# Altium schematic sheet TL200_V1.1-后板.SchDoc
size A3
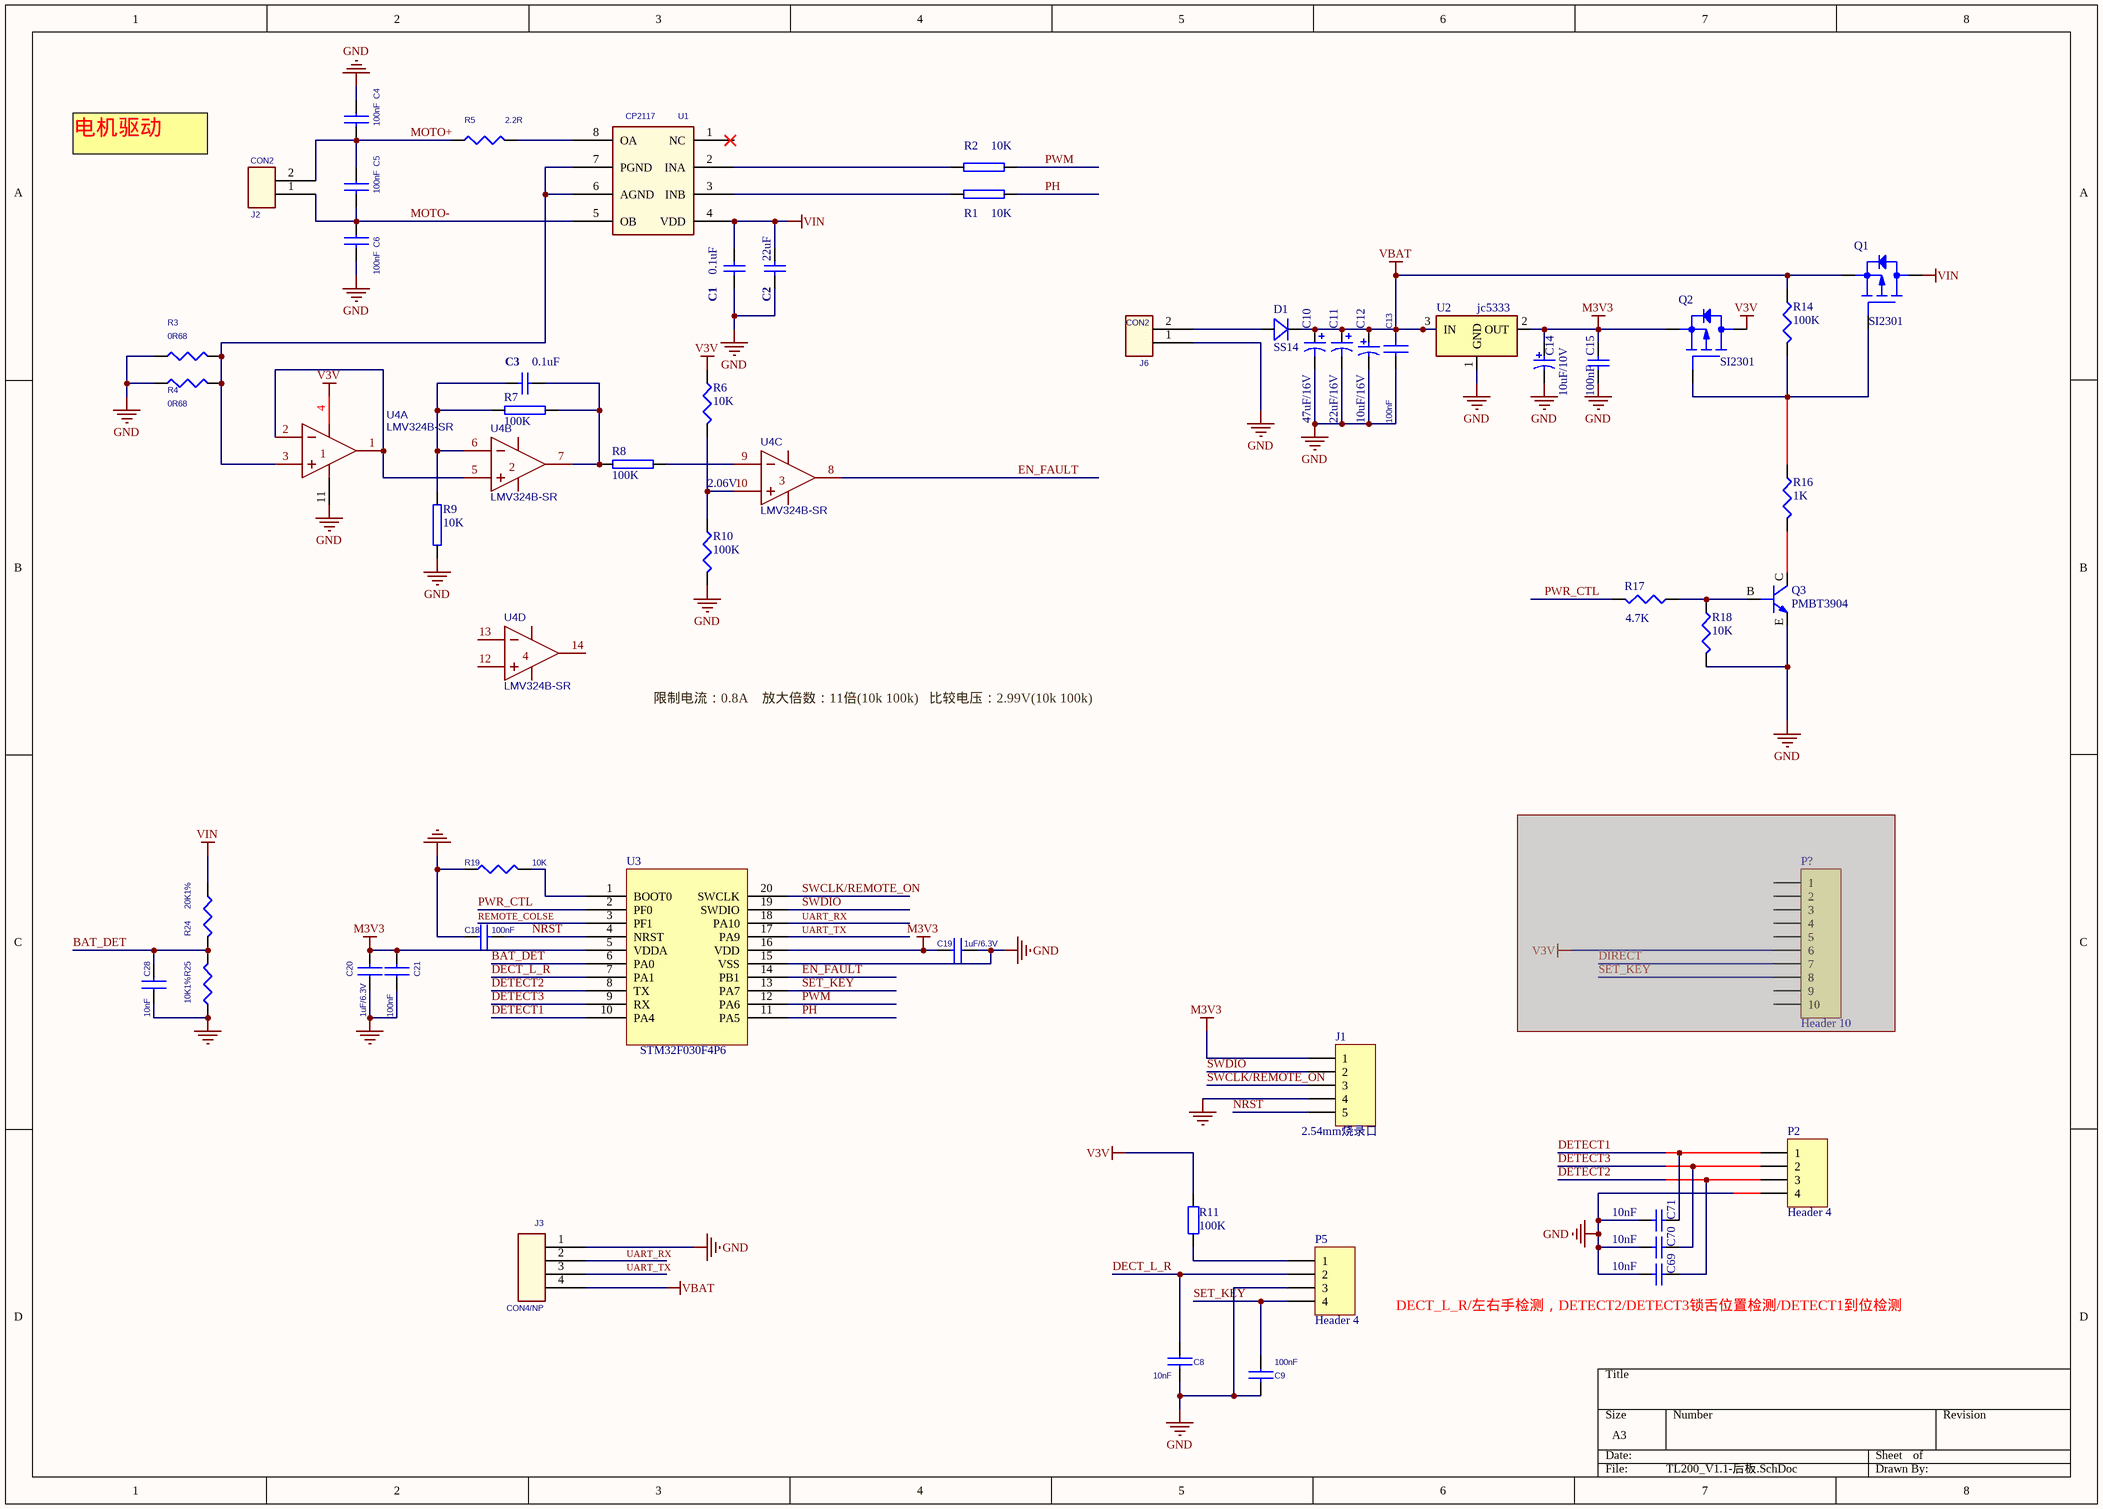
[diagram p0: TL200_V1.1-后板.SchDoc]

## Parts
C1  0.1uF  [LC-0603_C]
C2  22uF  [LC-0805_C]
C3  0.1uF  [LC-0603_C]
C4  100nF  [C0603]
C5  100nF  [C0603]
C6  100nF  [C0603]
C8  10nF  [LC-0603_C]
C9  100nF  [LC-0603_C]
C10  47uF/16V  [LC-0805_C]
C11  22uF/16V  [LC-0805_C]
C12  10uF/16V  [LC-0805_C]
C13  100nF  [C0603]
C14  10uF/10V  [LC-0805_C]
C15  100nF  [LC-0603_C]
C18  100nF  [LC-0603_C]
C19  1uF/6.3V  [LC-0603_C]
C20  1uF/6.3V  [LC-0603_C]
C21  100nF  [LC-0603_C]
C28  10nF  [LC-0603_C]
C69  10nF  [C0603]
C70  10nF  [C0603]
C71  10nF  [C0603]
D1  SS14  [M7]
J1  2.54mm烧录口  [5P-2.54mm - duplicate]
J2  CON2  [2PIN-2.0]
J3  CON4/NP  [4p-2.0xx]
J6  CON2  [2PIN-2.0]
P2  Header 4  [4P-1.25]
P5  Header 4  [4P-1.25]
P?  Header 10  [10p-2.0]  (masked out: inside a compile mask, not in the netlist)
Q1  SI2301  [SOT-23 - GDS]
Q2  SI2301  [SOT-23 - GDS]
Q3  PMBT3904  [SOT-23 - BCE]
R1  10K  [LC-0603_R]
R2  10K  [LC-0603_R]
R3  0R68  [LC-0603_R]
R4  0R68  [LC-0603_R]
R5  2.2R  [0805_R]
R6  10K  [LC-0603_R]
R7  100K  [LC-0603_R]
R8  100K  [LC-0603_R]
R9  10K  [LC-0603_R]
R10  100K  [LC-0603_R]
R11  100K  [LC-0603_R]
R14  100K  [LC-0603_R]
R16  1K  [LC-0603_R]
R17  4.7K  [LC-0603_R]
R18  10K  [LC-0603_R]
R19  10K  [LC-0603_R]
R24  20K1%  [LC-0603_R]
R25  10K1%  [LC-0603_R]
U1  CP2117  [SOP8]
U2  jc5333  [SOT-23-3L]
U3  STM32F030F4P6  [TSSOP20L1xx]
U4  LMV324B-SR  [SOIC-14_L8.7-W3.9-P1.27-LS6.0-BL]  (parts A,B,C,D of 4)

## Nets
GND: C1.2 C2.2 C4.1 C6.2 C8.2 C9.2 C10.2 C11.2 C12.2 C13.2 C14.2 C15.2 C18.1 C19.1 C20.1 C21.1 C28.1 C69.2 C70.2 C71.2 J1.4 J3.1 J6.1 P2.4 P5.3 Q3.E(EMITTER) R3.1 R4.1 R9.2 R10.2 R18.2 R19.1 R25.1 U2.1(GND) U3.15(VSS) U4.11(-VS)
M3V3: C14.1 C15.1 C19.2 C20.2 C21.2 J1.1 Q2.S(SOURCE) U2.2(OUT) U3.5(VDDA) U3.16(VDD)
V3V: Q2.D(DRAIN) R6.1 R11.2 U4.4(+VS)
VBAT: C10.1 C11.1 C12.1 C13.1 D1.K J3.4 Q1.S(SOURCE) R14.1 U2.3(IN)
VIN: C1.1 C2.1 Q1.D(DRAIN) R24.1 U1.4(VDD)
BAT_DET: C28.2 R24.2 R25.2 U3.6(PA0)
DECT_L_R: C8.1 P5.2 U3.7(PA1)
DETECT1: C71.1 P2.1 U3.10(PA4)
DETECT2: C69.1 P2.3 U3.8(TX)
DETECT3: C70.1 P2.2 U3.9(RX)
EN_FAULT: U3.14(PB1) U4.8(OUTC)
MOTO+: C4.2 C5.1 J2.2 R5.1
MOTO-: C5.2 C6.1 J2.1 U1.5(OB)
NRST: C18.2 J1.5 U3.4(NRST)
PH: R1.1 U3.11(PA5)
PWM: R2.1 U3.12(PA6)
PWR_CTL: R17.2 U3.2(PF0)
REMOTE_COLSE: U3.3(PF1)
SET_KEY: C9.1 P5.4 U3.13(PA7)
SWCLK/REMOTE_ON: J1.3 U3.20(SWCLK)
SWDIO: J1.2 U3.19(SWDIO)
UART_RX: J3.2 U3.18(PA10)
UART_TX: J3.3 U3.17(PA9)
NetC3_1: C3.1 R7.2 R9.1 U4.6(INB-)
NetC3_2: C3.2 R7.1 R8.1 U4.7(OUTB)
NetD1_A: D1.A J6.2
NetP5_1: P5.1 R11.1
NetQ1_G: Q1.G(GATE) Q2.G(GATE) R14.2 R16.1
NetQ3_B: Q3.B(BASE) R17.1 R18.1
NetQ3_C: Q3.C(COLLECTOR) R16.2
NetR1_2: R1.2 U1.3(INB)
NetR2_2: R2.2 U1.2(INA)
NetR3_2: R3.2 R4.2 U1.6(AGND) U1.7(PGND) U4.3(INA+)
NetR5_2: R5.2 U1.8(OA)
NetR6_2: R6.2 R10.1 U4.10(INC+)
NetR8_2: R8.2 U4.9(INC-)
NetR19_2: R19.2 U3.1(BOOT0)
NetU4_1: U4.1(OUTA) U4.2(INA-) U4.5(INB+)

Not connected (* = marked no-connect by the designer): U1 1(NC); U4 12(IND+) 13(IND-) 14(OUTD)

## Notes on the sheet
- 电机驱动
- (near U4) 2.06V
- 限制电流：0.8A    放大倍数：11倍(10k 100k)   比较电压：2.99V(10k 100k)
- (near C69) DECT_L_R/左右手检测，DETECT2/DETECT3锁舌位置检测/DETECT1到位检测

## Library data of the parts
C1-C3 C15 C69-C71 = CAP-NP: Capacitor, Ceramic; Capacitance: 18 pF; Dielectric: COG; Polarity: Non-Polarized; Rated Voltage: 50 mV; Tolerance: 5 %; Category: Capacitor; Mounting Technology: Surface Mount; Status: Unreleased; Technology: Ceramic
C4-C6 C8 C9 C13 C18-C21 C28 = CAP NP
C10 C11 = Cap Pol3: Polarized Capacitor (Surface Mount); Value: 100pF; Published: 8-Jun-2000; LatestRevisionDate: 17-Jul-2002; LatestRevisionNote: Re-released for DXP Platform.; PackageReference: C0805; Publisher: Altium Limited
C12 C14 = CAP-P: Capacitor, tolerance ±20%
D1 = D
J1 = Header 5: Header, 5-Pin; LatestRevisionDate: 17-Jul-2002; LatestRevisionNote: Re-released for DXP Platform.; Publisher: Altium Limited
J3 = CON4
P2 P5 = Header 4: Header, 4-Pin; LatestRevisionDate: 17-Jul-2002; LatestRevisionNote: Re-released for DXP Platform.; Publisher: Altium Limited
P? = Header 10: Header, 10-Pin; LatestRevisionDate: 17-Jul-2002; LatestRevisionNote: Re-released for DXP Platform.; Publisher: Altium Limited
Q1 Q2 = PWRMOSFET_EP_DGS_0
R1 R2 R7-R9 = Pro71C3.TMP_UnNamed_1
R3-R5 R19 R24 R25 = R_Dup1
R6 R10 R14 R16-R18 = R
R11 = Res2: Resistor; Value: 1K; Published: 2013年12月24日; LatestRevisionDate: 2013年12月24日; LatestRevisionNote: Re-released for DXP Platform.
U1 = AM24LC02_0
U2 = XC6206P302M
U3 = Component_1
U4 = LMV324B-SR: BOM_Manufacturer: 3PEAK; subpart_no: 1; BOM_Supplier: LCSC; BOM_Supplier Part: C248570; BOM_Manufacturer Part: LMV324B-SR; spicePre: U; spiceSymbolName: LMV324B-SR